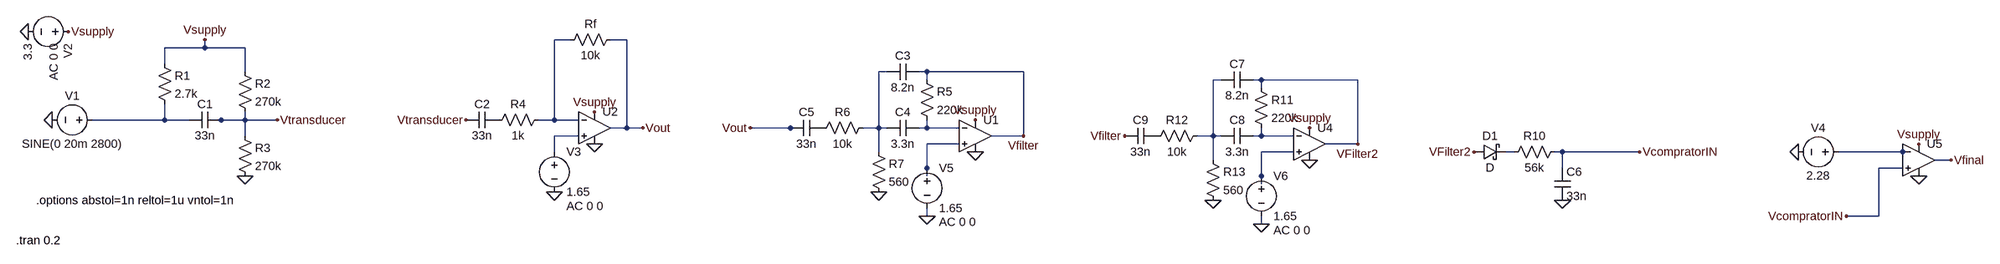
[diagram p0: schematic FullSim.asc]
FullSim.asc, the LTspice schematic file:
Version 4
SHEET 1 4980 700
WIRE 1072 0 1040 0
WIRE 1184 0 1152 0
WIRE 256 16 256 0
WIRE 256 16 176 16
WIRE 336 16 256 16
WIRE 176 48 176 16
WIRE 336 64 336 16
WIRE 1872 64 1856 64
WIRE 1952 64 1936 64
WIRE 2144 64 1952 64
WIRE 1952 80 1952 64
WIRE 2544 80 2528 80
WIRE 2624 80 2608 80
WIRE 2816 80 2624 80
WIRE 2624 96 2624 80
WIRE 176 160 176 128
WIRE 176 160 32 160
WIRE 224 160 176 160
WIRE 288 160 272 160
WIRE 336 160 336 144
WIRE 336 160 288 160
WIRE 400 160 336 160
WIRE 1040 160 1040 0
WIRE 1040 160 1008 160
WIRE 1088 160 1040 160
WIRE 1184 176 1184 0
WIRE 1184 176 1152 176
WIRE 1216 176 1184 176
WIRE 1680 176 1600 176
WIRE 1696 176 1680 176
WIRE 1856 176 1856 64
WIRE 1856 176 1824 176
WIRE 1872 176 1856 176
WIRE 1952 176 1952 160
WIRE 1952 176 1936 176
WIRE 2016 176 1952 176
WIRE 336 192 336 160
WIRE 1088 192 1040 192
WIRE 2144 192 2144 64
WIRE 2144 192 2080 192
WIRE 2368 192 2352 192
WIRE 2528 192 2528 80
WIRE 2528 192 2496 192
WIRE 2544 192 2528 192
WIRE 2624 192 2624 176
WIRE 2624 192 2608 192
WIRE 2688 192 2624 192
WIRE 2016 208 1952 208
WIRE 2816 208 2816 80
WIRE 2816 208 2752 208
WIRE 1040 224 1040 192
WIRE 1856 224 1856 176
WIRE 2688 224 2624 224
WIRE 3536 224 3520 224
WIRE 3632 224 3616 224
WIRE 3792 224 3632 224
WIRE 4576 224 4448 224
WIRE 4592 224 4576 224
WIRE 2528 240 2528 192
WIRE 4672 240 4640 240
WIRE 1952 256 1952 208
WIRE 3632 256 3632 224
WIRE 4576 256 4528 256
WIRE 1952 272 1952 256
WIRE 2624 272 2624 224
WIRE 2624 288 2624 272
WIRE 1952 352 1952 336
WIRE 4528 352 4528 256
WIRE 4528 352 4464 352
WIRE 2624 368 2624 352
FLAG -96 -16 0
FLAG -16 -16 Vsupply
FLAG -48 160 0
FLAG 256 0 Vsupply
FLAG 400 160 Vtransducer
FLAG 336 272 0
FLAG 1120 208 0
FLAG 1120 144 Vsupply
FLAG 1216 176 Vout
FLAG 864 160 Vtransducer
FLAG 1856 304 0
FLAG 2048 224 0
FLAG 2048 160 Vsupply
FLAG 1040 304 0
FLAG 1952 352 0
FLAG 1600 176 Vout
FLAG 2144 192 Vfilter
FLAG 3792 224 VcompratorIN
FLAG 2528 320 0
FLAG 2720 240 0
FLAG 2720 176 Vsupply
FLAG 2624 368 0
FLAG 2352 192 Vfilter
FLAG 2816 208 VFilter2
FLAG 3456 224 VFilter2
FLAG 3632 320 0
FLAG 4368 224 0
FLAG 4464 352 VcompratorIN
FLAG 4608 272 0
FLAG 4608 208 Vsupply
FLAG 4672 240 Vfinal
SYMBOL voltage 48 160 R90
WINDOW 0 -32 56 VBottom 2
WINDOW 3 32 56 VTop 2
WINDOW 123 0 0 Left 0
WINDOW 39 0 0 Left 0
SYMATTR InstName V1
SYMATTR Value SINE(0 20m 2800)
SYMBOL voltage 0 -16 R90
WINDOW 123 24 44 Left 2
WINDOW 39 0 0 Left 0
SYMATTR Value2 AC 0 0
SYMATTR InstName V2
SYMATTR Value 3.3
SYMBOL cap 288 144 R90
WINDOW 0 0 32 VBottom 2
WINDOW 3 32 32 VTop 2
SYMATTR InstName C1
SYMATTR Value 33n
SYMBOL res 320 48 R0
SYMATTR InstName R2
SYMATTR Value 270k
SYMBOL res 320 176 R0
SYMATTR InstName R3
SYMATTR Value 270k
SYMBOL res 160 32 R0
SYMATTR InstName R1
SYMATTR Value 2.7k
SYMBOL cap 928 144 R90
WINDOW 0 0 32 VBottom 2
WINDOW 3 32 32 VTop 2
SYMATTR InstName C2
SYMATTR Value 33n
SYMBOL res 1024 144 R90
WINDOW 0 0 56 VBottom 2
WINDOW 3 32 56 VTop 2
SYMATTR InstName R4
SYMATTR Value 1k
SYMBOL OpAmps\\UniversalOpAmp2 1120 176 R0
SYMATTR InstName U2
SYMATTR Value2 ""
SYMATTR SpiceLine Aol=100k GBW=10Meg Slew=5.5Meg Vos=0.5m
SYMATTR SpiceLine2 Rin=1Meg Rout=75
SYMBOL res 1168 -16 R90
WINDOW 0 0 56 VBottom 2
WINDOW 3 32 56 VTop 2
SYMATTR InstName Rf
SYMATTR Value 10k
SYMBOL cap 1936 48 R90
WINDOW 0 0 32 VBottom 2
WINDOW 3 32 32 VTop 2
SYMATTR InstName C3
SYMATTR Value 8.2n
SYMBOL cap 1936 160 R90
WINDOW 0 0 32 VBottom 2
WINDOW 3 32 32 VTop 2
SYMATTR InstName C4
SYMATTR Value 3.3n
SYMBOL res 1936 64 R0
SYMATTR InstName R5
SYMATTR Value 220k
SYMBOL res 1840 160 R90
WINDOW 0 0 56 VBottom 2
WINDOW 3 32 56 VTop 2
SYMATTR InstName R6
SYMATTR Value 10k
SYMBOL res 1840 208 R0
SYMATTR InstName R7
SYMATTR Value 560
SYMBOL cap 1744 160 R90
WINDOW 0 0 32 VBottom 2
WINDOW 3 32 32 VTop 2
SYMATTR InstName C5
SYMATTR Value 33n
SYMBOL voltage 1040 208 R0
WINDOW 123 24 124 Left 2
WINDOW 39 0 0 Left 0
SYMATTR Value2 AC 0 0
SYMATTR InstName V3
SYMATTR Value 1.65
SYMBOL voltage 1952 240 R0
WINDOW 123 24 124 Left 2
WINDOW 39 0 0 Left 0
SYMATTR Value2 AC 0 0
SYMATTR InstName V5
SYMATTR Value 1.65
SYMBOL schottky 3456 240 R270
WINDOW 0 32 32 VTop 2
WINDOW 3 0 32 VBottom 2
SYMATTR InstName D1
SYMBOL cap 3616 320 M180
WINDOW 0 24 56 Left 2
WINDOW 3 24 8 Left 2
SYMATTR InstName C6
SYMATTR Value 33n
SYMBOL res 3632 208 R90
WINDOW 0 0 56 VBottom 2
WINDOW 3 32 56 VTop 2
SYMATTR InstName R10
SYMATTR Value 56k
SYMBOL cap 2608 64 R90
WINDOW 0 0 32 VBottom 2
WINDOW 3 32 32 VTop 2
SYMATTR InstName C7
SYMATTR Value 8.2n
SYMBOL cap 2608 176 R90
WINDOW 0 0 32 VBottom 2
WINDOW 3 32 32 VTop 2
SYMATTR InstName C8
SYMATTR Value 3.3n
SYMBOL res 2608 80 R0
SYMATTR InstName R11
SYMATTR Value 220k
SYMBOL res 2512 176 R90
WINDOW 0 0 56 VBottom 2
WINDOW 3 32 56 VTop 2
SYMATTR InstName R12
SYMATTR Value 10k
SYMBOL res 2512 224 R0
SYMATTR InstName R13
SYMATTR Value 560
SYMBOL cap 2416 176 R90
WINDOW 0 0 32 VBottom 2
WINDOW 3 32 32 VTop 2
SYMATTR InstName C9
SYMATTR Value 33n
SYMBOL voltage 2624 256 R0
WINDOW 123 24 124 Left 2
WINDOW 39 0 0 Left 0
SYMATTR Value2 AC 0 0
SYMATTR InstName V6
SYMATTR Value 1.65
SYMBOL voltage 4464 224 R90
WINDOW 0 -32 56 VBottom 2
WINDOW 3 32 56 VTop 2
WINDOW 123 0 0 Left 0
WINDOW 39 0 0 Left 0
SYMATTR InstName V4
SYMATTR Value 2.28
SYMBOL OpAmps\\UniversalOpAmp2 2048 192 R0
SYMATTR InstName U1
SYMATTR Value2 ""
SYMATTR SpiceLine Aol=100k GBW=10Meg Slew=5.5Meg Vos=0.5m
SYMATTR SpiceLine2 Rin=1Meg Rout=75
SYMBOL OpAmps\\UniversalOpAmp2 2720 208 R0
SYMATTR InstName U4
SYMATTR Value2 ""
SYMATTR SpiceLine Aol=100k GBW=10Meg Slew=5.5Meg Vos=0.5m
SYMATTR SpiceLine2 Rin=1Meg Rout=75
SYMBOL OpAmps\\UniversalOpAmp2 4608 240 R0
SYMATTR InstName U5
SYMATTR Value2 ""
SYMATTR SpiceLine Aol=100k GBW=10Meg Slew=5.5Meg Vos=0.5m
SYMATTR SpiceLine2 Rin=1Meg Rout=75
TEXT -80 320 Left 2 !.options abstol=1n reltol=1u vntol=1n
TEXT -120 400 Left 2 !.tran 0.2

The netlist it stands for:
* FullSim.asc
V1 N004 0 SINE(0 20m 2800)
V2 Vsupply 0 3.3 AC 0 0
C1 Vtransducer N004 33n
R2 Vsupply Vtransducer 270k
R3 Vtransducer 0 270k
R1 Vsupply N004 2.7k
C2 P001 Vtransducer 33n
R4 N001 P001 1k
XU2 N006 N001 Vsupply 0 Vout level2 Aol=100k GBW=10Meg Slew=5.5Meg Vos=0.5m Rin=1Meg Rout=75  ; pins In+ In- V+ V- OUT
Rf Vout N001 10k
C3 Vfilter N002 8.2n
C4 N005 N002 3.3n
R5 Vfilter N005 220k
R6 N002 P002 10k
R7 N002 0 560
C5 P002 Vout 33n
V3 N006 0 1.65 AC 0 0
V5 N008 0 1.65 AC 0 0
D1 VFilter2 N010 D
C6 0 VcompratorIN 33n
R10 VcompratorIN N010 56k
C7 VFilter2 N003 8.2n
C8 N007 N003 3.3n
R11 VFilter2 N007 220k
R12 N003 P003 10k
R13 N003 0 560
C9 P003 Vfilter 33n
V6 N009 0 1.65 AC 0 0
V4 N011 0 2.28
XU1 N008 N005 Vsupply 0 Vfilter level2 Aol=100k GBW=10Meg Slew=5.5Meg Vos=0.5m Rin=1Meg Rout=75  ; pins In+ In- V+ V- OUT
XU4 N009 N007 Vsupply 0 VFilter2 level2 Aol=100k GBW=10Meg Slew=5.5Meg Vos=0.5m Rin=1Meg Rout=75  ; pins In+ In- V+ V- OUT
XU5 VcompratorIN N011 Vsupply 0 Vfinal level2 Aol=100k GBW=10Meg Slew=5.5Meg Vos=0.5m Rin=1Meg Rout=75  ; pins In+ In- V+ V- OUT
.model D D
.lib standard.dio
.options abstol=1n reltol=1u vntol=1n
.tran 0.2
.lib UniversalOpAmp2.lib
.backanno
.end